# Altium schematic sheet ArduinoPWR-DIG_SDCard.SchDoc
size A
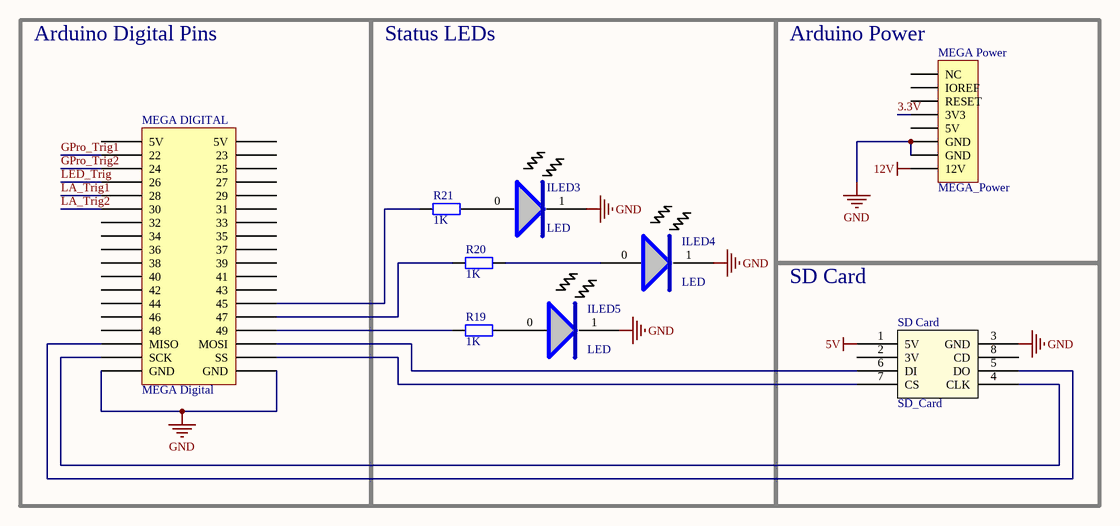
[diagram p0: ArduinoPWR-DIG_SDCard.SchDoc]

## Parts
ILED3  LED  [LED]
ILED4  LED  [LED]
ILED5  LED  [LED]
MEGA_DIGITAL  MEGA Digital  [HDR2X18]
MEGA_Power  MEGA_Power  [HDR1X8]
R19  value 1K  [AXIAL-0.4]  (hidden comment: Res2)
R20  value 1K  [AXIAL-0.4]  (hidden comment: Res2)
R21  value 1K  [AXIAL-0.4]  (hidden comment: Res2)
SD_Card  SD_Card  [HDR1X8]

## Blocks framed on the sheet
Arduino Digital Pins: MEGA_DIGITAL
Status LEDs: ILED3-ILED5 R19-R21
Arduino Power: MEGA_Power
SD Card: SD_Card

## Nets
5V: SD_Card.1(5V)
12V: MEGA_Power.8(12V)
GND: ILED3.1 ILED4.1 ILED5.1 MEGA_DIGITAL.35(GND) MEGA_DIGITAL.36(GND) MEGA_Power.6(GND) MEGA_Power.7(GND) SD_Card.3(GND)
3.3V: MEGA_Power.4(3V3)
GPro_Trig1: MEGA_DIGITAL.5(22)
GPro_Trig2: MEGA_DIGITAL.25(24)
LA_Trig1: MEGA_DIGITAL.9(28)
LA_Trig2: MEGA_DIGITAL.11(30)
LED_Trig: MEGA_DIGITAL.7(26)
NetILED3_0: ILED3.0 R21.1
NetILED4_0: ILED4.0 R20.1
NetILED5_0: ILED5.0 R19.1
NetMEGA_DIGITAL_26: MEGA_DIGITAL.26(45) R21.2
NetMEGA_DIGITAL_28: MEGA_DIGITAL.28(47) R20.2
NetMEGA_DIGITAL_30: MEGA_DIGITAL.30(49) R19.2
NetMEGA_DIGITAL_31: MEGA_DIGITAL.31(MISO) SD_Card.5(DO)
NetMEGA_DIGITAL_32: MEGA_DIGITAL.32(MOSI) SD_Card.6(DI)
NetMEGA_DIGITAL_33: MEGA_DIGITAL.33(SCK) SD_Card.4(CLK)
NetMEGA_DIGITAL_34: MEGA_DIGITAL.34(SS) SD_Card.7(CS)

Not connected (* = marked no-connect by the designer): MEGA_DIGITAL 1(5V) 2(5V) 3(44) 4(23) 6(25) 8(27) 10(29) 12(31) 13(32) 14(33) 15(34) 16(35) 17(36) 18(37) 19(38) 20(39) 21(40) 22(41) 23(42) 24(43) 27(46) 29(48); MEGA_Power 1(NC) 2(IOREF) 3(RESET) 5(5V); SD_Card 2(3V) 8(CD)

## Notes on the sheet
- Title
- Size:
- Date:
- A
- Number:
- Time:
- Revision:
- Sheet
- of
- File:

## Library data of the parts
MEGA_DIGITAL SD_Card = Component_1
MEGA_Power = Header 8: Header, 8-Pin; LatestRevisionDate: 17-Jul-2002; LatestRevisionNote: Re-released for DXP Platform.; Publisher: Altium Limited
R19-R21 = Res2: Resistor; Published: 8-Jun-2000; LatestRevisionDate: 17-Jul-2002; LatestRevisionNote: Re-released for DXP Platform.; PackageReference: AXIAL-0.4; Publisher: Altium Limited; PackageDescription: Axial Device, Thru-Hole; 2 Leads; 0.4 in Pin Spacing